# Altium schematic sheet pedal.SchDoc
size A4
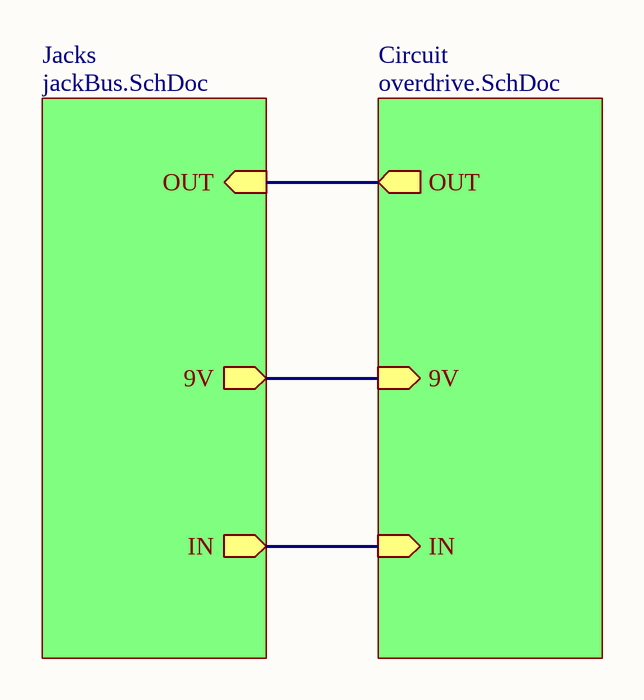
[diagram p0: pedal.SchDoc]

## Sub-sheets
Circuit = overdrive.SchDoc: OUT (out), 9V (in), IN (in)
Jacks = jackBus.SchDoc: OUT (in), 9V (out), IN (out)

## Nets
(unnamed): sheet Jacks/OUT, sheet Circuit/OUT
(unnamed): sheet Jacks/9V, sheet Circuit/9V
(unnamed): sheet Jacks/IN, sheet Circuit/IN